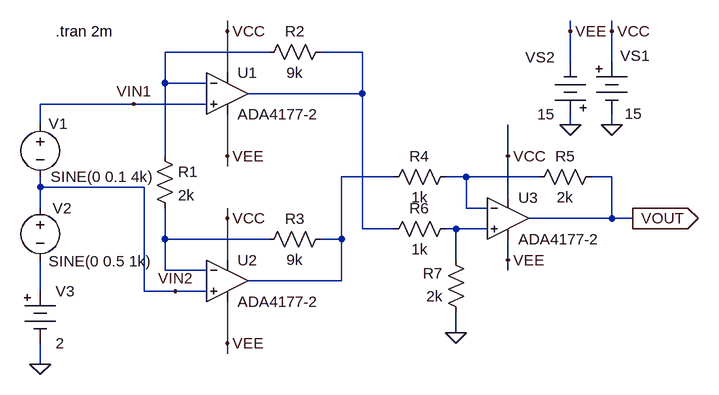
[diagram p0: schematic fig-01-02-20.asc]
fig-01-02-20.asc, the LTspice schematic file:
Version 4
SHEET 1 880 680
WIRE -48 -112 -48 -128
WIRE 480 -112 480 -128
WIRE 544 -112 544 -128
WIRE 16 -80 -144 -80
WIRE 160 -80 96 -80
WIRE 480 -64 480 -112
WIRE 544 -64 544 -112
WIRE -48 -48 -48 -112
WIRE -144 -32 -144 -80
WIRE -80 -32 -144 -32
WIRE 160 -16 160 -80
WIRE 160 -16 -16 -16
WIRE -192 0 -336 0
WIRE -80 0 -192 0
WIRE -336 32 -336 0
WIRE 480 32 480 16
WIRE 544 32 544 16
WIRE -144 80 -144 -32
WIRE -48 80 -48 16
WIRE 384 80 384 32
WIRE -48 96 -48 80
WIRE 208 112 128 112
WIRE 320 112 288 112
WIRE 432 112 320 112
WIRE 544 112 512 112
WIRE -336 128 -336 112
WIRE -176 128 -336 128
WIRE 384 144 384 80
WIRE -336 160 -336 128
WIRE 320 160 320 112
WIRE 352 160 320 160
WIRE -48 176 -48 160
WIRE 544 176 544 112
WIRE 544 176 416 176
WIRE 576 176 544 176
WIRE 160 192 160 -16
WIRE 208 192 160 192
WIRE 304 192 288 192
WIRE 352 192 304 192
WIRE -144 208 -144 160
WIRE 16 208 -144 208
WIRE 128 208 128 112
WIRE 128 208 96 208
WIRE -48 240 -48 176
WIRE 304 240 304 192
WIRE 384 240 384 208
WIRE -144 256 -144 208
WIRE -80 256 -144 256
WIRE 384 256 384 240
WIRE 128 272 128 208
WIRE 128 272 -16 272
WIRE -336 288 -336 240
WIRE -176 288 -176 128
WIRE -128 288 -176 288
WIRE -80 288 -128 288
WIRE 304 352 304 320
WIRE -48 368 -48 304
WIRE -48 384 -48 368
WIRE -336 400 -336 368
FLAG 304 352 0
FLAG 576 176 VOUT
IOPIN 576 176 Out
FLAG -192 0 VIN1
FLAG -336 400 0
FLAG -128 288 VIN2
FLAG 384 80 VCC
FLAG 384 240 VEE
FLAG -48 -112 VCC
FLAG -48 176 VCC
FLAG -48 80 VEE
FLAG -48 368 VEE
FLAG 480 32 0
FLAG 544 32 0
FLAG 480 -112 VEE
FLAG 544 -112 VCC
SYMBOL res 304 96 R90
WINDOW 0 0 56 VBottom 2
WINDOW 3 32 56 VTop 2
SYMATTR InstName R4
SYMATTR Value 1k
SYMBOL res 528 96 R90
WINDOW 0 0 56 VBottom 2
WINDOW 3 32 56 VTop 2
SYMATTR InstName R5
SYMATTR Value 2k
SYMBOL voltage -336 16 R0
WINDOW 0 13 14 Left 2
WINDOW 3 16 96 Left 2
WINDOW 123 0 0 Left 0
WINDOW 39 0 0 Left 0
SYMATTR InstName V1
SYMATTR Value SINE(0 0.1 4k)
SYMBOL res 304 176 R90
WINDOW 0 0 56 VBottom 2
WINDOW 3 32 56 VTop 2
SYMATTR InstName R6
SYMATTR Value 1k
SYMBOL res 320 336 R180
WINDOW 0 36 76 Left 2
WINDOW 3 36 40 Left 2
SYMATTR InstName R7
SYMATTR Value 2k
SYMBOL voltage -336 144 R0
WINDOW 0 19 16 Left 2
WINDOW 3 13 98 Left 2
WINDOW 123 0 0 Left 0
WINDOW 39 0 0 Left 0
SYMATTR InstName V2
SYMATTR Value SINE(0 0.5 1k)
SYMBOL Misc\\battery -336 272 R0
WINDOW 123 0 0 Left 0
WINDOW 39 0 0 Left 0
SYMATTR InstName V3
SYMATTR Value 2
SYMBOL res -160 64 R0
SYMATTR InstName R1
SYMATTR Value 2k
SYMBOL res 112 -96 R90
WINDOW 0 0 56 VBottom 2
WINDOW 3 32 56 VTop 2
SYMATTR InstName R2
SYMATTR Value 9k
SYMBOL res 112 192 R90
WINDOW 0 0 56 VBottom 2
WINDOW 3 32 56 VTop 2
SYMATTR InstName R3
SYMATTR Value 9k
SYMBOL Misc\\battery 544 -80 R0
WINDOW 0 13 6 Left 2
WINDOW 3 20 95 Left 2
SYMATTR InstName VS1
SYMATTR Value 15
SYMBOL Misc\\battery 480 32 R180
WINDOW 0 24 104 Left 2
WINDOW 3 24 16 Left 2
SYMATTR InstName VS2
SYMATTR Value 15
SYMBOL Opamps\\ADA4177-2 -48 -16 R0
SYMATTR InstName U1
SYMBOL Opamps\\ADA4177-2 -48 272 R0
SYMATTR InstName U2
SYMBOL Opamps\\ADA4177-2 384 176 R0
SYMATTR InstName U3
TEXT -312 -112 Left 2 !.tran 2m

The netlist it stands for:
* fig-01-02-20.asc
R4 N004 N003 1k
R5 VOUT N004 2k
V1 VIN1 VIN2 SINE(0 0.1 4k)
R6 N005 N002 1k
R7 0 N005 2k
V2 VIN2 N007 SINE(0 0.5 1k)
V3 N007 0 2
R1 N001 N006 2k
R2 N002 N001 9k
R3 N003 N006 9k
VS1 VCC 0 15
VS2 0 VEE 15
* U1: ADA4177-2 (symbol Opamps\ADA4177-2 not available, pins judged from their places): In+=VIN1 In-=N001 V+=VCC V-=VEE OUT=N002
* U2: ADA4177-2 (symbol Opamps\ADA4177-2 not available, pins judged from their places): In+=VIN2 In-=N006 V+=VCC V-=VEE OUT=N003
* U3: ADA4177-2 (symbol Opamps\ADA4177-2 not available, pins judged from their places): In+=N005 In-=N004 V+=VCC V-=VEE OUT=VOUT
.tran 2m
.backanno
.end